# Altium schematic sheet Sheet8.SchDoc
size A4
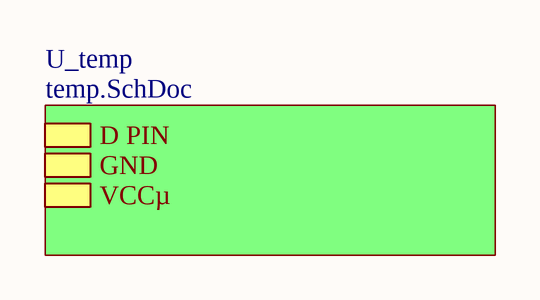
[diagram p0: Sheet8.SchDoc]

## Sub-sheets
U_temp = temp.SchDoc: D PIN, GND, VCCµ